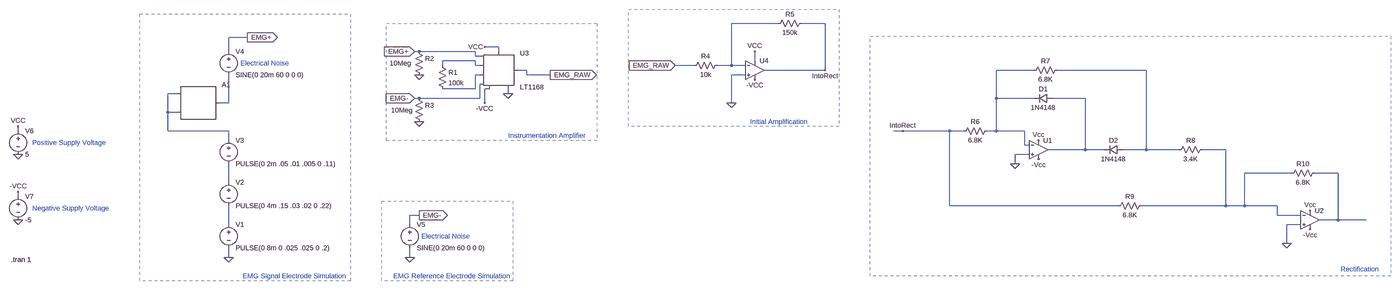
[diagram p0: schematic Rectification.asc, whole sheet]
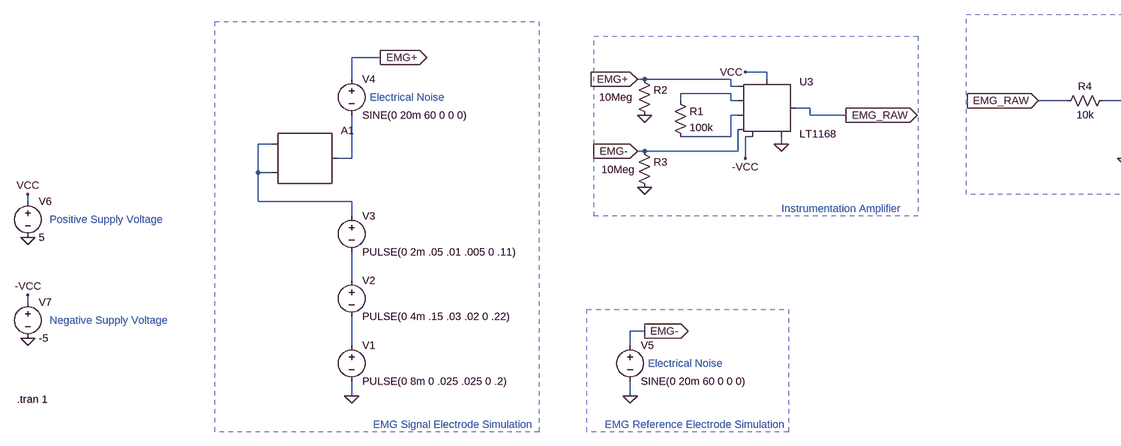
[diagram p1: schematic Rectification.asc, part, row 1 of 1, column 1 of 2]
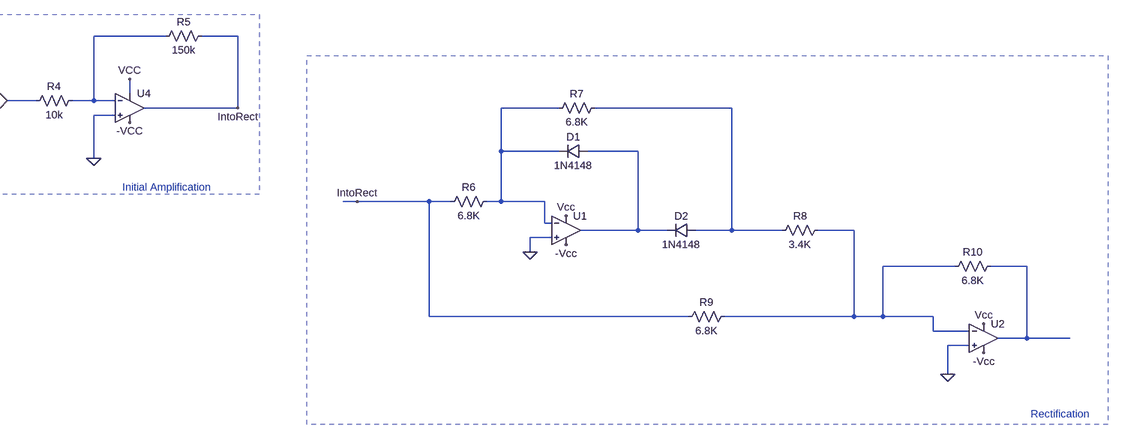
[diagram p2: schematic Rectification.asc, part, row 1 of 1, column 2 of 2]
Rectification.asc, the LTspice schematic file:
Version 4
SHEET 1 4136 784
WIRE 2000 -240 1840 -240
WIRE 2160 -240 2080 -240
WIRE -16 -192 -80 -192
WIRE 848 -160 800 -160
WIRE -80 -144 -80 -192
WIRE 576 -144 560 -144
WIRE 768 -144 576 -144
WIRE 848 -144 848 -160
WIRE 768 -128 768 -144
WIRE 784 -128 768 -128
WIRE 768 -112 656 -112
WIRE 1920 -112 1920 -144
WIRE 656 -96 656 -112
WIRE 768 -96 768 -112
WIRE 784 -96 768 -96
WIRE 1712 -96 1648 -96
WIRE 1840 -96 1840 -240
WIRE 1840 -96 1792 -96
WIRE 1888 -96 1840 -96
WIRE 944 -80 912 -80
WIRE 2160 -80 2160 -240
WIRE 2160 -80 1952 -80
WIRE 2912 -80 2784 -80
WIRE 3296 -80 2992 -80
WIRE 784 -64 768 -64
WIRE 944 -64 944 -80
WIRE 1024 -64 944 -64
WIRE 1888 -64 1840 -64
WIRE 768 -16 768 -64
WIRE 768 -16 656 -16
WIRE 816 -16 800 -16
WIRE -256 0 -288 0
WIRE 880 0 880 -16
WIRE 576 16 560 16
WIRE 784 16 784 -32
WIRE 784 16 576 16
WIRE 2784 16 2784 -80
WIRE 2912 16 2784 16
WIRE 3088 16 2976 16
WIRE -80 32 -80 -64
WIRE -80 32 -112 32
WIRE 800 32 800 -16
WIRE 1840 32 1840 -64
WIRE -288 64 -288 0
WIRE -256 64 -288 64
WIRE -848 128 -848 112
WIRE -288 128 -288 64
WIRE -80 128 -288 128
WIRE 2464 128 2432 128
WIRE 2624 128 2464 128
WIRE 2672 128 2624 128
WIRE 2784 128 2784 16
WIRE 2784 128 2752 128
WIRE 2880 128 2784 128
WIRE -80 160 -80 128
WIRE 2880 176 2880 128
WIRE 2896 176 2880 176
WIRE 3088 192 3088 16
WIRE 3088 192 2960 192
WIRE 3152 192 3088 192
WIRE 3296 192 3296 -80
WIRE 3296 192 3216 192
WIRE 3408 192 3296 192
WIRE 3568 192 3488 192
WIRE 2896 208 2848 208
WIRE 2848 240 2848 208
WIRE 3792 272 3632 272
WIRE 3952 272 3872 272
WIRE -80 304 -80 240
WIRE -848 352 -848 336
WIRE 2624 384 2624 128
WIRE 3200 384 2624 384
WIRE 3568 384 3568 192
WIRE 3568 384 3280 384
WIRE 3632 384 3632 272
WIRE 3632 384 3568 384
WIRE 3744 384 3632 384
WIRE 576 416 544 416
WIRE 3744 416 3744 384
WIRE 3824 416 3744 416
WIRE 3952 432 3952 272
WIRE 3952 432 3888 432
WIRE 4048 432 3952 432
WIRE -80 448 -80 384
WIRE 544 448 544 416
WIRE 3824 448 3776 448
WIRE 3776 512 3776 448
WIRE -80 560 -80 528
WIRE 544 560 544 528
FLAG -80 560 0
FLAG 544 560 0
FLAG -16 -192 EMG+
IOPIN -16 -192 Out
FLAG 576 416 EMG-
IOPIN 576 416 Out
FLAG 560 -144 EMG+
IOPIN 560 -144 In
FLAG 560 16 EMG-
IOPIN 560 16 In
FLAG -848 208 0
FLAG -848 432 0
FLAG -848 112 VCC
FLAG -848 336 -VCC
FLAG 800 32 -VCC
FLAG 800 -160 VCC
FLAG 880 0 0
FLAG 1024 -64 EMG_RAW
IOPIN 1024 -64 Out
FLAG 576 -64 0
FLAG 576 96 0
FLAG 1648 -96 EMG_RAW
IOPIN 1648 -96 In
FLAG 1840 32 0
FLAG 1920 -144 VCC
FLAG 1920 -48 -VCC
FLAG 2848 240 0
FLAG 3776 512 0
FLAG 2928 160 Vcc
FLAG 3856 400 Vcc
FLAG 3856 464 -Vcc
FLAG 2928 224 -Vcc
FLAG 2160 -80 IntoRect
FLAG 2464 128 IntoRect
SYMBOL voltage -80 432 R0
WINDOW 123 0 0 Left 0
WINDOW 39 0 0 Left 0
SYMATTR InstName V1
SYMATTR Value PULSE(0 8m 0 .025 .025 0 .2)
SYMBOL modulate -256 0 R0
WINDOW 3 0 0 Invisible 0
SYMATTR Value mark=50k space=0
SYMATTR InstName A1
SYMBOL voltage -80 288 R0
WINDOW 123 0 0 Left 0
WINDOW 39 0 0 Left 0
SYMATTR InstName V2
SYMATTR Value PULSE(0 4m .15 .03 .02 0 .22)
SYMBOL voltage -80 144 R0
WINDOW 123 0 0 Left 0
WINDOW 39 0 0 Left 0
SYMATTR InstName V3
SYMATTR Value PULSE(0 2m .05 .01 .005 0 .11)
SYMBOL voltage -80 -160 R0
WINDOW 123 0 0 Left 0
WINDOW 39 0 0 Left 0
SYMATTR InstName V4
SYMATTR Value SINE(0 20m 60 0 0 0)
SYMBOL voltage 544 432 R0
WINDOW 123 0 0 Left 0
WINDOW 39 0 0 Left 0
SYMATTR InstName V5
SYMATTR Value SINE(0 20m 60 0 0 0)
SYMBOL res 640 -112 R0
SYMATTR InstName R1
SYMATTR Value 100k
SYMBOL voltage -848 112 R0
WINDOW 123 0 0 Left 0
WINDOW 39 0 0 Left 0
SYMATTR InstName V6
SYMATTR Value 5
SYMBOL voltage -848 336 R0
WINDOW 123 0 0 Left 0
WINDOW 39 0 0 Left 0
SYMATTR InstName V7
SYMATTR Value -5
SYMBOL res 560 -160 R0
WINDOW 3 -85 56 Left 2
SYMATTR Value 10Meg
SYMATTR InstName R2
SYMBOL res 560 0 R0
WINDOW 3 -80 57 Left 2
SYMATTR Value 10Meg
SYMATTR InstName R3
SYMBOL res 1808 -112 R90
WINDOW 0 0 56 VBottom 2
WINDOW 3 32 56 VTop 2
SYMATTR InstName R4
SYMATTR Value 10k
SYMBOL res 2096 -256 R90
WINDOW 0 0 56 VBottom 2
WINDOW 3 32 56 VTop 2
SYMATTR InstName R5
SYMATTR Value 150k
SYMBOL LT1168 848 -80 R0
SYMATTR InstName U3
SYMBOL UniversalOpamp2 1920 -80 R0
SYMATTR InstName U4
SYMBOL res 2768 112 R90
WINDOW 0 0 56 VBottom 2
WINDOW 3 32 56 VTop 2
SYMATTR InstName R6
SYMATTR Value 6.8K
SYMBOL res 3008 -96 R90
WINDOW 0 0 56 VBottom 2
WINDOW 3 32 56 VTop 2
SYMATTR InstName R7
SYMATTR Value 6.8K
SYMBOL res 3504 176 R90
WINDOW 0 0 56 VBottom 2
WINDOW 3 32 56 VTop 2
SYMATTR InstName R8
SYMATTR Value 3.4K
SYMBOL res 3296 368 R90
WINDOW 0 0 56 VBottom 2
WINDOW 3 32 56 VTop 2
SYMATTR InstName R9
SYMATTR Value 6.8K
SYMBOL res 3888 256 R90
WINDOW 0 0 56 VBottom 2
WINDOW 3 32 56 VTop 2
SYMATTR InstName R10
SYMATTR Value 6.8K
SYMBOL diode 2976 0 R90
WINDOW 0 0 32 VBottom 2
WINDOW 3 32 32 VTop 2
SYMATTR InstName D1
SYMATTR Value 1N4148
SYMBOL diode 3216 176 R90
WINDOW 0 0 32 VBottom 2
WINDOW 3 32 32 VTop 2
SYMATTR InstName D2
SYMATTR Value 1N4148
SYMBOL OpAmps/UniversalOpAmp 2928 192 R0
SYMATTR InstName U1
SYMBOL OpAmps/UniversalOpAmp 3856 432 R0
SYMATTR InstName U2
TEXT -872 568 Left 2 !.tran 1
TEXT -800 168 Left 2 ;Positive Supply Voltage
TEXT -800 392 Left 2 ;Negative Supply Voltage
TEXT -32 624 Left 2 ;EMG Signal Electrode Simulation
TEXT 488 624 Left 2 ;EMG Reference Electrode Simulation
TEXT -40 -104 Left 2 ;Electrical Noise
TEXT 584 488 Left 2 ;Electrical Noise
TEXT 880 144 Left 2 ;Instrumentation Amplifier
TEXT 1904 96 Left 2 ;Initial Amplification
TEXT 3960 600 Left 2 ;Rectification
RECTANGLE Normal 336 640 -384 -272 2
RECTANGLE Normal 896 640 448 368 2
RECTANGLE Normal 1184 160 464 -240 2
RECTANGLE Normal 2208 112 1488 -288 2
RECTANGLE Normal 2352 -196 4132 624 2

The netlist it stands for:
* Rectification.asc
V1 N012 0 PULSE(0 8m 0 .025 .025 0 .2)
A1 N006 N006 0 0 0 0 N008 0 MODULATOR mark=50k space=0
V2 N011 N012 PULSE(0 4m .15 .03 .02 0 .22)
V3 N006 N011 PULSE(0 2m .05 .01 .005 0 .11)
V4 EMG+ N008 SINE(0 20m 60 0 0 0)
V5 EMG- 0 SINE(0 20m 60 0 0 0)
R1 N002 N005 100k
V6 VCC 0 5
V7 -VCC 0 -5
R2 EMG+ 0 10Meg
R3 EMG- 0 10Meg
R4 N001 EMG_RAW 10k
R5 IntoRect N001 150k
XU3 N002 EMG- EMG+ -VCC 0 EMG_RAW VCC N005 LT1168
XU4 0 N001 VCC -VCC IntoRect level.2 Avol=1Meg GBW=10Meg Slew=10Meg ilimit=25m rail=0 Vos=0 phimargin=45 en=0 enk=0 in=0 ink=0 Rin=500Meg  ; pins IN+ IN- V+ V- OUT
R6 N003 IntoRect 6.8K
R7 N004 N003 6.8K
R8 N009 N004 3.4K
R9 N009 IntoRect 6.8K
R10 N010 N009 6.8K
D1 N007 N003 1N4148
D2 N004 N007 1N4148
XU1 0 N003 VCC -VCC N007 level1 Avol=1Meg GBW=10Meg Vos=0 En=0 Enk=0 In=0 Ink=0 Rin=500Meg  ; pins In+ In- V+ V- OUT
XU2 0 N009 VCC -VCC N010 level1 Avol=1Meg GBW=10Meg Vos=0 En=0 Enk=0 In=0 Ink=0 Rin=500Meg  ; pins In+ In- V+ V- OUT
.model D D
.lib standard.dio
.tran 1
* Positive Supply Voltage
* Negative Supply Voltage
* EMG Signal Electrode Simulation
* EMG Reference Electrode Simulation
* Electrical Noise
* Electrical Noise
* Instrumentation Amplifier
* Initial Amplification
* Rectification
.lib LTC.lib
.lib UniversalOpamps2.sub
.lib UniversalOpAmp1.lib
.backanno
.end